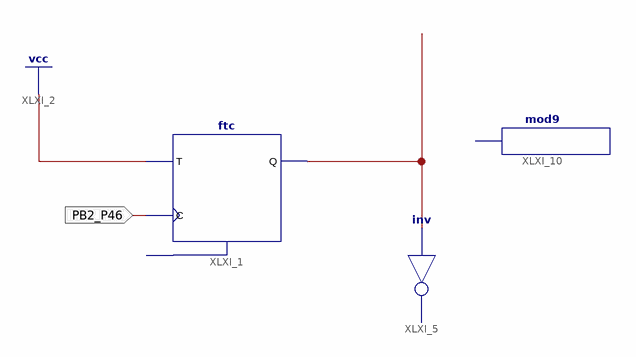
[diagram p0: schematic sheet 1]
// Xilinx ISE schematic main.sch (spartan6) as structural Verilog: 3 symbols, 1 ports
module main (
  input  PB2_P46
);

  wire XLXN_5;

  ftc XLXI_1 (.C(PB2_P46), .T(1'b1), .Q(XLXN_5));  // open: CLR
  // inv XLXI_5 has open pins: I=XLXN_5, O=open
  mod9 XLXI_10 ();  // open: butCount
endmodule
